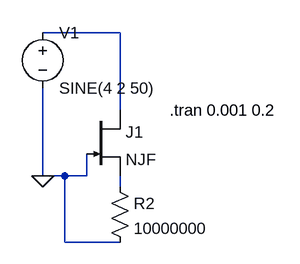
[diagram p0: schematic nJFET_CurrentSource.asc]
nJFET_CurrentSource.asc, the LTspice schematic file:
Version 4
SHEET 1 1004 680
WIRE 448 176 336 176
WIRE 448 288 448 176
WIRE 336 384 336 256
WIRE 368 384 336 384
WIRE 400 384 400 352
WIRE 400 384 368 384
WIRE 448 400 448 384
WIRE 368 480 368 384
WIRE 448 480 368 480
FLAG 336 384 0
SYMBOL njf 400 288 R0
SYMATTR InstName J1
SYMBOL voltage 336 160 R0
SYMATTR InstName V1
SYMATTR Value SINE(4 2 50)
SYMBOL res 432 384 R0
SYMATTR InstName R2
SYMATTR Value 10000000
TEXT 520 288 Left 2 !.tran 0.001 0.2

The netlist it stands for:
* nJFET_CurrentSource.asc
J1 N001 0 N002 NJF
V1 N001 0 SINE(4 2 50)
R2 N002 0 10000000
.model NJF NJF
.model PJF PJF
.lib standard.jft
.tran 0.001 0.2
.backanno
.end